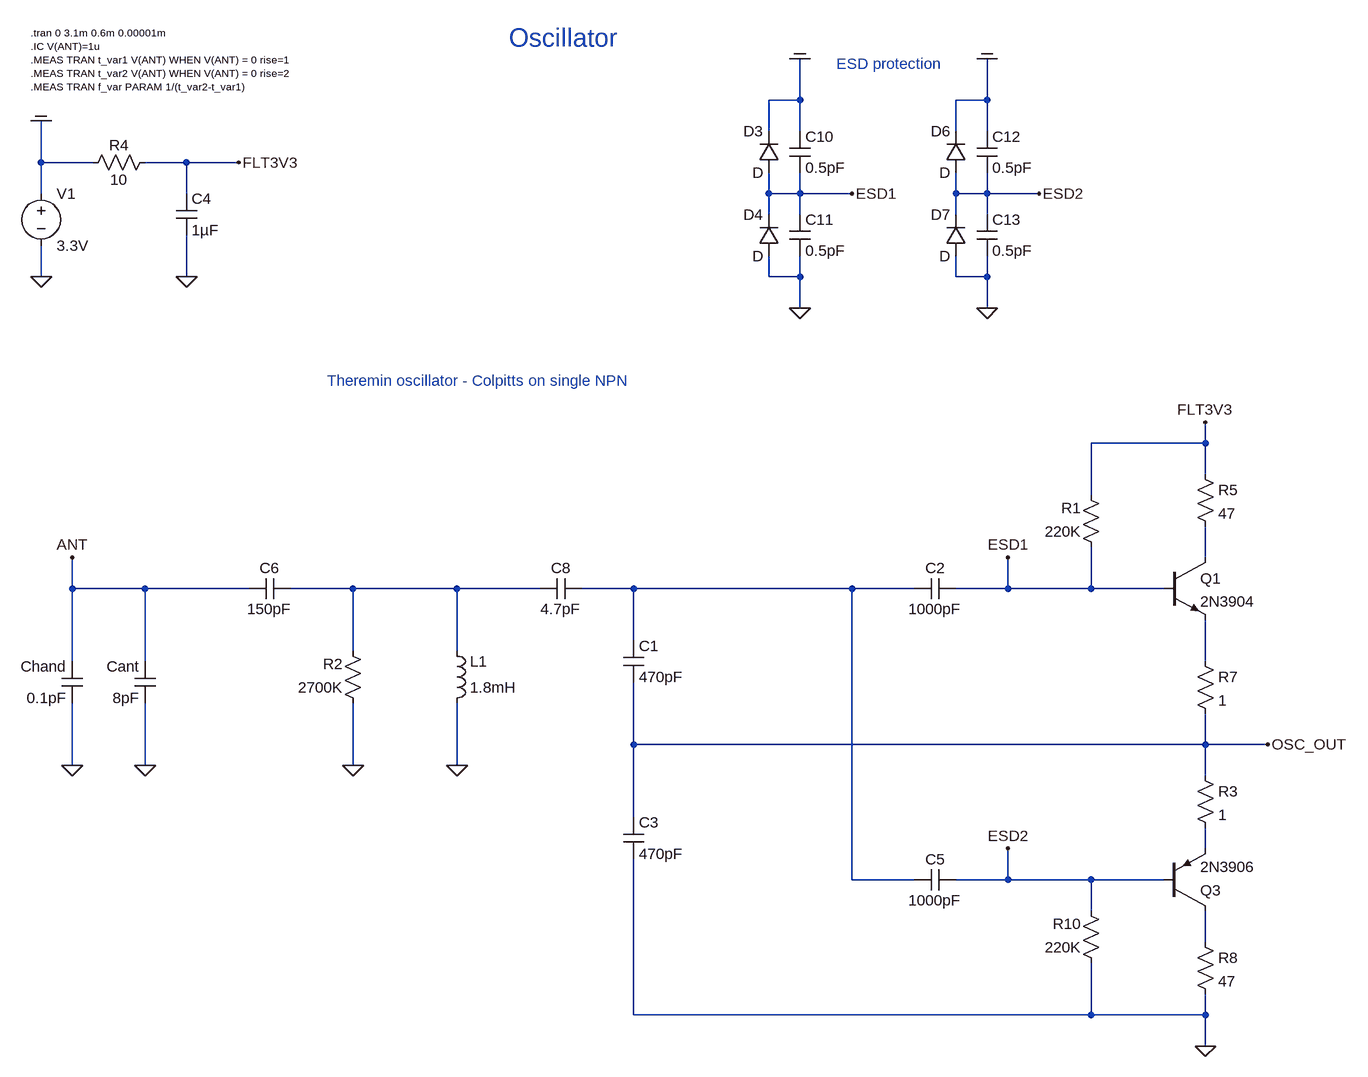
[diagram p0: schematic 2020_npn_no_pnp_osc_v17.asc]
2020_npn_no_pnp_osc_v17.asc, the LTspice schematic file:
Version 4
SHEET 1 2908 2724
WIRE 176 -96 176 -160
WIRE 176 -96 128 -96
WIRE 464 -96 464 -160
WIRE 464 -96 416 -96
WIRE 128 -48 128 -96
WIRE 176 -48 176 -96
WIRE 416 -48 416 -96
WIRE 464 -48 464 -96
WIRE -992 0 -992 -64
WIRE -912 0 -992 0
WIRE -768 0 -832 0
WIRE -688 0 -768 0
WIRE -992 48 -992 0
WIRE -768 48 -768 0
WIRE 128 48 128 16
WIRE 176 48 176 16
WIRE 176 48 128 48
WIRE 256 48 176 48
WIRE 416 48 416 16
WIRE 464 48 464 16
WIRE 464 48 416 48
WIRE 544 48 464 48
WIRE 128 80 128 48
WIRE 176 80 176 48
WIRE 416 80 416 48
WIRE 464 80 464 48
WIRE -992 176 -992 128
WIRE -768 176 -768 112
WIRE 128 176 128 144
WIRE 176 176 176 144
WIRE 176 176 128 176
WIRE 416 176 416 144
WIRE 464 176 464 144
WIRE 464 176 416 176
WIRE 176 224 176 176
WIRE 464 224 464 176
WIRE 800 432 800 400
WIRE 800 432 624 432
WIRE 800 480 800 432
WIRE 624 512 624 432
WIRE 800 608 800 560
WIRE -944 656 -944 608
WIRE -832 656 -944 656
WIRE -672 656 -832 656
WIRE -512 656 -608 656
WIRE -352 656 -512 656
WIRE -224 656 -352 656
WIRE -80 656 -160 656
WIRE 256 656 -80 656
WIRE 352 656 256 656
WIRE 496 656 496 608
WIRE 496 656 416 656
WIRE 624 656 624 592
WIRE 624 656 496 656
WIRE 736 656 624 656
WIRE -80 736 -80 656
WIRE -512 752 -512 656
WIRE -352 752 -352 656
WIRE -944 768 -944 656
WIRE -832 768 -832 656
WIRE 800 768 800 704
WIRE -80 896 -80 800
WIRE 800 896 800 848
WIRE 800 896 -80 896
WIRE 896 896 800 896
WIRE -944 928 -944 832
WIRE -832 928 -832 832
WIRE -512 928 -512 832
WIRE -352 928 -352 832
WIRE 800 944 800 896
WIRE -80 1008 -80 896
WIRE 800 1056 800 1024
WIRE 256 1104 256 656
WIRE 352 1104 256 1104
WIRE 496 1104 496 1056
WIRE 496 1104 416 1104
WIRE 624 1104 496 1104
WIRE 736 1104 624 1104
WIRE 624 1152 624 1104
WIRE 800 1200 800 1152
WIRE -80 1312 -80 1072
WIRE 624 1312 624 1232
WIRE 624 1312 -80 1312
WIRE 800 1312 800 1280
WIRE 800 1312 624 1312
WIRE 800 1360 800 1312
FLAG -992 176 0
FLAG -944 928 0
FLAG -944 608 ANT
FLAG -992 -64 COM
FLAG 176 224 0
FLAG 176 -160 COM
FLAG 256 48 ESD1
FLAG 464 224 0
FLAG 464 -160 COM
FLAG 544 48 ESD2
FLAG -832 928 0
FLAG 496 608 ESD1
FLAG -768 176 0
FLAG -512 928 0
FLAG -352 928 0
FLAG -688 0 FLT3V3
FLAG 800 400 FLT3V3
FLAG 896 896 OSC_OUT
FLAG 800 1360 0
FLAG 496 1056 ESD2
SYMBOL voltage -992 32 R0
WINDOW 123 0 0 Left 2
WINDOW 39 0 0 Left 2
SYMATTR InstName V1
SYMATTR Value 3.3V
SYMBOL ind -368 848 M180
WINDOW 0 36 80 Left 2
WINDOW 3 36 40 Left 2
SYMATTR InstName L1
SYMATTR Value 1.8mH
SYMATTR SpiceLine Ipk=0.1 Rser=82 Rpar=20Meg Cpar=1.286pF
SYMBOL cap -928 768 M0
SYMATTR InstName Chand
SYMATTR Value 0.1pF
SYMBOL diode 144 16 R180
WINDOW 0 24 64 Left 2
WINDOW 3 24 0 Left 2
SYMATTR InstName D3
SYMBOL diode 144 144 R180
WINDOW 0 24 64 Left 2
WINDOW 3 24 0 Left 2
SYMATTR InstName D4
SYMBOL cap 160 -48 R0
SYMATTR InstName C10
SYMATTR Value 0.5pF
SYMBOL cap 160 80 R0
SYMATTR InstName C11
SYMATTR Value 0.5pF
SYMBOL diode 432 16 R180
WINDOW 0 24 64 Left 2
WINDOW 3 24 0 Left 2
SYMATTR InstName D6
SYMBOL diode 432 144 R180
WINDOW 0 24 64 Left 2
WINDOW 3 24 0 Left 2
SYMATTR InstName D7
SYMBOL cap 448 -48 R0
SYMATTR InstName C12
SYMATTR Value 0.5pF
SYMBOL cap 448 80 R0
SYMATTR InstName C13
SYMATTR Value 0.5pF
SYMBOL cap -816 768 M0
SYMATTR InstName Cant
SYMATTR Value 8pF
SYMBOL res -816 -16 R90
WINDOW 0 5 56 VBottom 2
WINDOW 3 27 56 VTop 2
SYMATTR InstName R4
SYMATTR Value 10
SYMBOL cap -784 48 R0
SYMATTR InstName C4
SYMATTR Value 1µF
SYMBOL res 640 608 R180
WINDOW 0 31 76 Left 2
WINDOW 3 31 40 Left 2
SYMATTR InstName R1
SYMATTR Value 220K
SYMBOL res -496 848 R180
WINDOW 0 31 76 Left 2
WINDOW 3 31 40 Left 2
SYMATTR InstName R2
SYMATTR Value 2700K
SYMBOL cap -96 736 R0
SYMATTR InstName C1
SYMATTR Value 470pF
SYMBOL cap -96 1008 R0
SYMATTR InstName C3
SYMATTR Value 470pF
SYMBOL npn 736 608 R0
SYMATTR InstName Q1
SYMATTR Value 2N3904
SYMBOL cap -160 640 R90
WINDOW 0 0 32 VBottom 2
WINDOW 3 32 32 VTop 2
SYMATTR InstName C8
SYMATTR Value 4.7pF
SYMBOL pnp 736 1152 M180
SYMATTR InstName Q3
SYMATTR Value 2N3906
SYMBOL res 784 752 R0
SYMATTR InstName R7
SYMATTR Value 1
SYMBOL res 640 1248 R180
WINDOW 0 31 76 Left 2
WINDOW 3 31 40 Left 2
SYMATTR InstName R10
SYMATTR Value 220K
SYMBOL cap 416 640 R90
WINDOW 0 0 32 VBottom 2
WINDOW 3 32 32 VTop 2
SYMATTR InstName C2
SYMATTR Value 1000pF
SYMBOL cap 416 1088 R90
WINDOW 0 0 32 VBottom 2
WINDOW 3 32 32 VTop 2
SYMATTR InstName C5
SYMATTR Value 1000pF
SYMBOL res 784 928 R0
SYMATTR InstName R3
SYMATTR Value 1
SYMBOL cap -608 640 R90
WINDOW 0 0 32 VBottom 2
WINDOW 3 32 32 VTop 2
SYMATTR InstName C6
SYMATTR Value 150pF
SYMBOL res 784 464 R0
SYMATTR InstName R5
SYMATTR Value 47
SYMBOL res 784 1184 R0
SYMATTR InstName R8
SYMATTR Value 47
TEXT -1008 -200 Left 1 !.tran 0 3.1m 0.6m 0.00001m\n.IC V(ANT)=1u\n.MEAS TRAN t_var1 V(ANT) WHEN V(ANT) = 0 rise=1\n.MEAS TRAN t_var2 V(ANT) WHEN V(ANT) = 0 rise=2\n.MEAS TRAN f_var PARAM 1/(t_var2-t_var1)
TEXT 232 -152 Left 2 ;ESD protection
TEXT -272 -192 Left 4 ;Oscillator
TEXT -552 336 Left 2 ;Theremin oscillator - Colpitts on single NPN

The netlist it stands for:
* 2020_npn_no_pnp_osc_v17.asc
V1 COM 0 3.3V
L1 0 N002 1.8mH Ipk=0.1 Rser=82 Rpar=20Meg Cpar=1.286pF
Chand ANT 0 0.1pF
D3 ESD1 COM D
D4 0 ESD1 D
C10 COM ESD1 0.5pF
C11 ESD1 0 0.5pF
D6 ESD2 COM D
D7 0 ESD2 D
C12 COM ESD2 0.5pF
C13 ESD2 0 0.5pF
Cant ANT 0 8pF
R4 FLT3V3 COM 10
C4 FLT3V3 0 1µF
R1 ESD1 FLT3V3 220K
R2 0 N002 2700K
C1 N003 OSC_OUT 470pF
C3 OSC_OUT 0 470pF
Q1 N001 ESD1 N004 0 2N3904
C8 N003 N002 4.7pF
Q3 N006 ESD2 N005 0 2N3906
R7 N004 OSC_OUT 1
R10 0 ESD2 220K
C2 ESD1 N003 1000pF
C5 ESD2 N003 1000pF
R3 OSC_OUT N005 1
C6 N002 ANT 150pF
R5 FLT3V3 N001 47
R8 N006 0 47
.model D D
.lib standard.dio
.model NPN NPN
.model PNP PNP
.lib standard.bjt
.tran 0 3.1m 0.6m 0.00001m
.IC V(ANT)=1u
.MEAS TRAN t_var1 V(ANT) WHEN V(ANT) = 0 rise=1
.MEAS TRAN t_var2 V(ANT) WHEN V(ANT) = 0 rise=2
.MEAS TRAN f_var PARAM 1/(t_var2-t_var1)
* ESD protection
* Oscillator
* Theremin oscillator - Colpitts on single NPN
.backanno
.end